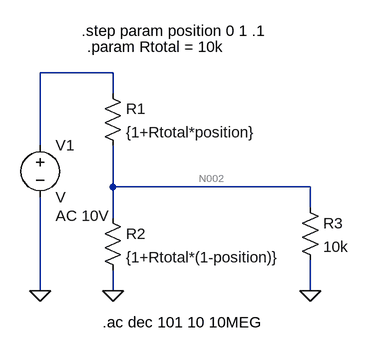
[diagram p0: schematic Draft4.asc]
Draft4.asc, the LTspice schematic file:
Version 4
SHEET 1 880 680
WIRE 144 112 32 112
WIRE 144 144 144 112
WIRE 32 224 32 112
WIRE 144 288 144 224
WIRE 448 288 144 288
WIRE 448 320 448 288
WIRE 144 336 144 288
WIRE 32 448 32 304
WIRE 144 448 144 416
WIRE 448 448 448 400
FLAG 32 448 0
FLAG 448 448 0
FLAG 144 448 0
SYMBOL voltage 32 208 R0
WINDOW 123 24 124 Left 2
WINDOW 39 0 0 Left 2
SYMATTR InstName V1
SYMATTR Value2 AC 10V
SYMATTR SpiceLine ""
SYMBOL res 128 128 R0
SYMATTR InstName R1
SYMATTR Value {1+Rtotal*position}
SYMATTR SpiceLine ""
SYMBOL res 128 320 R0
SYMATTR InstName R2
SYMATTR Value {1+Rtotal*(1-position)}
SYMATTR SpiceLine ""
SYMBOL res 432 304 R0
SYMATTR InstName R3
SYMATTR Value 10k
SYMATTR SpiceLine tol=10
TEXT 104 72 Left 2 !.param Rtotal = 10k
TEXT 96 48 Left 2 !.step param position 0 1 .1
TEXT 128 496 Left 2 !.ac dec 101 10 10MEG

The netlist it stands for:
* Draft4.asc
V1 N001 0 V AC 10V
R1 N001 N002 {1+Rtotal*position}
R2 N002 0 {1+Rtotal*(1-position)}
R3 N002 0 10k tol=10
.param Rtotal = 10k
.step param position 0 1 .1
.ac dec 101 10 10MEG
.backanno
.end

* Results of the author's LTspice run, read from the files saved beside the schematic
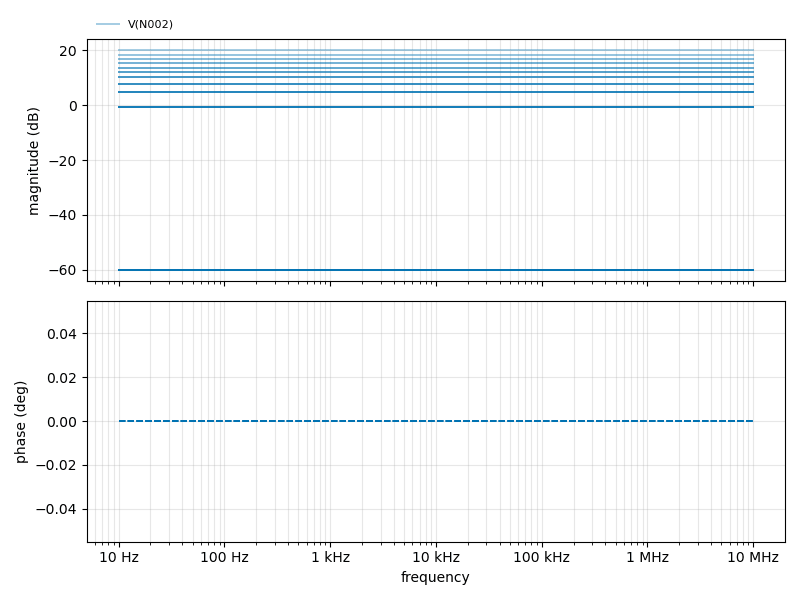
[diagram p1: AC Analysis of Draft4.asc, plotted from the saved traces]
* AC Analysis, 11 runs:
*   V(N002) [position=0]: 20.00 dB at 10 Hz, 20.00 dB at 10 MHz, peak 20.00 dB at 10 Hz
*   V(N002) [position=0.1]: 18.33 dB at 10 Hz, 18.33 dB at 10 MHz, peak 18.33 dB at 10 Hz
*   V(N002) [position=0.2]: 16.77 dB at 10 Hz, 16.77 dB at 10 MHz, peak 16.77 dB at 10 Hz
*   V(N002) [position=0.3]: 15.25 dB at 10 Hz, 15.25 dB at 10 MHz, peak 15.25 dB at 10 Hz
*   V(N002) [position=0.4]: 13.69 dB at 10 Hz, 13.69 dB at 10 MHz, peak 13.69 dB at 10 Hz
*   V(N002) [position=0.5]: 12.04 dB at 10 Hz, 12.04 dB at 10 MHz, peak 12.04 dB at 10 Hz
*   V(N002) [position=0.6]: 10.17 dB at 10 Hz, 10.17 dB at 10 MHz, peak 10.17 dB at 10 Hz
*   V(N002) [position=0.7]: 7.89 dB at 10 Hz, 7.89 dB at 10 MHz, peak 7.89 dB at 10 Hz